# Altium project ThermoGo.PrjPcb
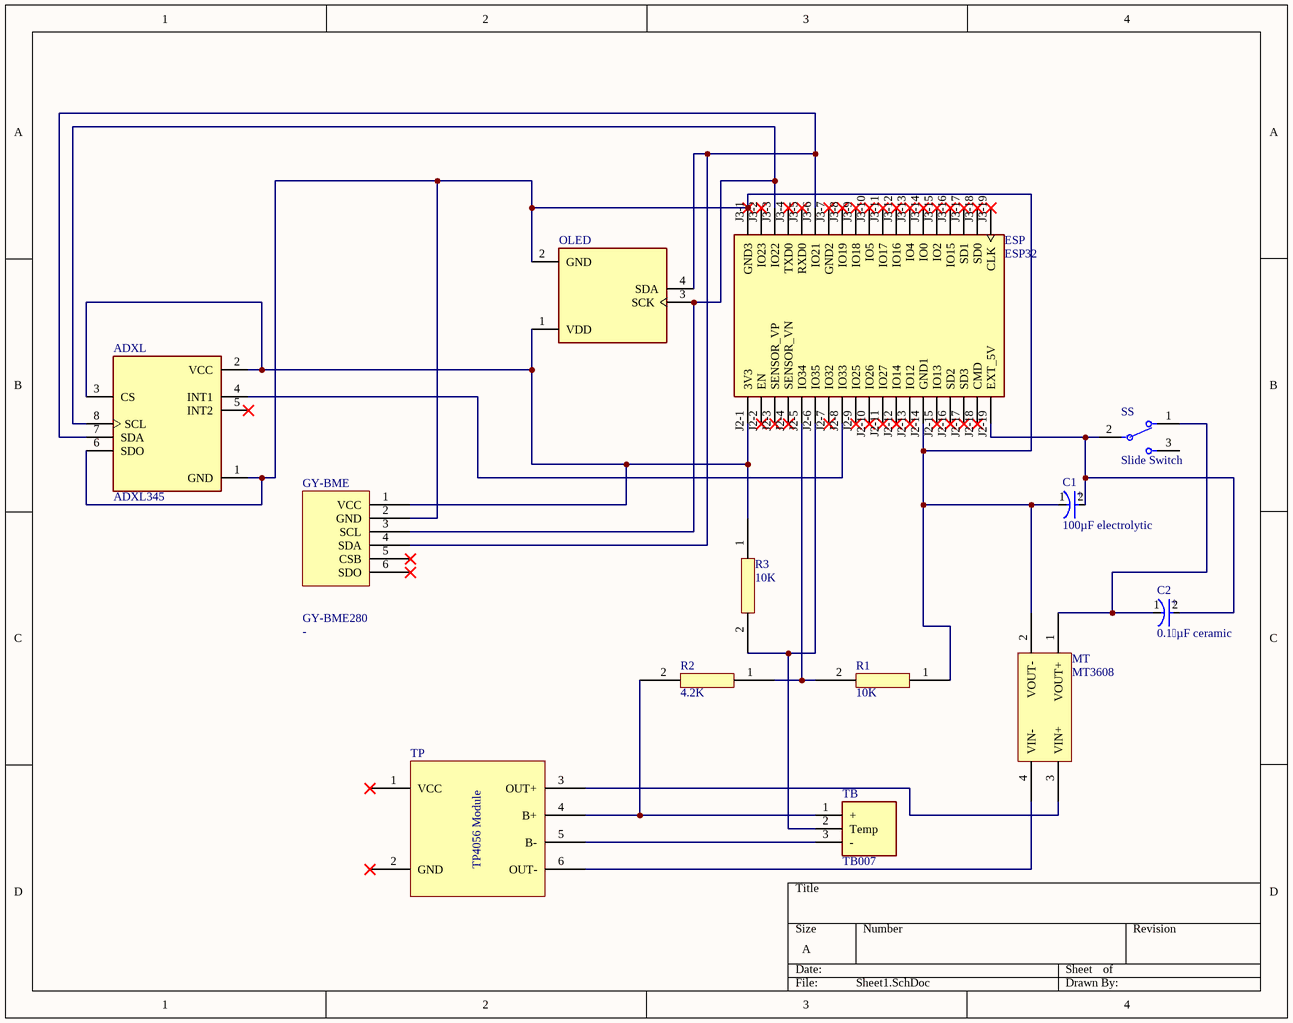
[diagram p0: Sheet1.SchDoc]
1 sheet, 13 parts. Net scope: global (net labels, ports and power ports of the same name join across sheets).
Board file: PCB1.PcbDoc

## Sheet Sheet1.SchDoc
size A; SheetNumber: 1; SheetTotal: 1

### Parts
ADXL  ADXL345  [ADXL345]
C1  100µF electrolytic  [FP-RAD-TH-D_6_3_0_5-L_11-MFG]
C2  0.1 µF ceramic  [FP-RAD-TH-D_6_3_0_5-L_11-MFG]
ESP  ESP32  [MODULE_ESP32-DEVKITC-32D]
GY-BME  -  [GY-BME280]
MT  MT3608  [MT3608]
OLED  (no value)  [LCD_OLED_128X64_1.3_I2C]
R1  10K  [resistor]
R2  4.2K  [resistor]
R3  10K  [resistor]
SS  Slide Switch  [FP-25436NAH6-MFG]
TB  TB007  [TB007]
TP  (no value)  [TP4056Module]

### Nets
NetADXL_1: ADXL.1(GND) ADXL.6(SDO) C1.1(C) ESP.J2-14(GND1) ESP.J3-1(GND3) GY-BME.2(GND) MT.2(VOUT-) OLED.2(GND) R1.1
NetADXL_2: ADXL.2(VCC) ADXL.3(CS) ESP.J2-1(3V3) GY-BME.1(VCC) OLED.1(VDD) R3.1
NetADXL_4: ADXL.4(INT1) ESP.J2-8(IO33)
NetADXL_7: ADXL.7(SDA) ESP.J3-6(IO21) GY-BME.4(SDA) OLED.4(SDA)
NetADXL_8: ADXL.8(SCL) ESP.J3-3(IO22) GY-BME.3(SCL) OLED.3(SCK)
NetC1_2: C1.2(A) C2.2(A) ESP.J2-19(EXT_5V) SS.2
NetC2_1: C2.1(C) MT.1(VOUT+) SS.1
NetESP_J2-5: ESP.J2-5(IO34) R1.2 R2.1
NetESP_J2-6: ESP.J2-6(IO35) R3.2 TB.2(Temp)
NetMT_3: MT.3(VIN+) TP.3(OUT+)
NetMT_4: MT.4(VIN-) TP.6(OUT-)
NetR2_2: R2.2 TB.1(+) TP.4(B+)
NetTB_3: TB.3(-) TP.5(B-)

Not connected (* = marked no-connect by the designer): ADXL 5(INT2)*; ESP J2-2(EN)* J2-3(SENSOR_VP)* J2-4(SENSOR_VN)* J2-7(IO32)* J2-9(IO25)* J2-10(IO26)* J2-11(IO27)* J2-12(IO14)* J2-13(IO12)* J2-15(IO13)* J2-16(SD2)* J2-17(SD3)* J2-18(CMD)* J3-2(IO23)* J3-4(TXD0)* J3-5(RXD0)* J3-7(GND2)* J3-8(IO19)* J3-9(IO18)* J3-10(IO5)* J3-11(IO17)* J3-12(IO16)* J3-13(IO4)* J3-14(IO0)* J3-15(IO2)* J3-16(IO15)* J3-17(SD1)* J3-18(SD0)* J3-19(CLK)*; GY-BME 5(CSB)* 6(SDO)*; SS 3; TP 1(VCC)* 2(GND)*

### Notes on the sheet
- (in symbol CMP-05427-000856-1) +
- (in symbol TP4056) TP4056 Module

### Library data of the parts
C1 C2 = CMP-05427-000856-1: Aluminum Electrolytic Capacitors (Radial Lead Type) 100uF ±20% 25V; Lead Diameter: 0.5mm; Polarity: Polar; Ripple Current: 455mA; Impedance: 130mR; Life (Hours): 2000Hour; Length: 11mm; Min Operating Temperature: -40°C; Termination: Radial; Diameter: 6mm; Lead Pitch: 5mm; Tolerance: 20%; Capacitance: 100uF; Case/Package: Radial; Voltage Rating (DC): 25V; Height - Seated (Max): 0.5inch; RoHS Compliant: Yes; Series: FM; Package Quantity: 2000; Voltage Rating: 25V; Max Operating Temperature: 105°C; Mount: Through Hole; ESR (Equivalent Series Resistance): 130mR; Packaging: Tape and Reel
GY-BME = GY-BME280
OLED = OLED_128X64_1.3_I2C: Non-Touch Graphic LCD Display Module Transmissive White OLED, Monochrome I2C 1.3 (33.02mm) 128 x 64; MF: UNIVERSAL-SOLDER Electronics Ltd; MP: OLED 128x64 1.3&quot; I2C; SnapEDA_Link: https://www.snapeda.com/parts/OLED%20128x64%201.3%22%20I2C/UNIVERSAL-SOLDER+Electronics+Ltd/view-part/?ref=snap; Package: None; Value: *; Check_prices: https://www.snapeda.com/parts/OLED%20128x64%201.3%22%20I2C/UNIVERSAL-SOLDER+Electronics+Ltd/view-part/?ref=eda
R1-R3 = resistor
SS = CMP-47022-000005-1: SWITCH SLIDE SPDT 4A 125V; Electrical Life: 10000Cycles; Switch Travel: 4mm; Actuator Type: Standard; Current Rating: 1A; Voltage Rating (DC): 30V; Actuator Material: Nylon; Mechanical Life: 20000Cycles; Actuator Length: 6mm; Contact Resistance: 10mR; Max Voltage Rating (AC): 250V; Switch Function: On-On; Packaging: Bulk; Package Quantity: 100; Contact Material: Silver; Orientation: Straight; Max Operating Temperature: 85°C; Min Operating Temperature: -40°C; Mount: Through Hole; Voltage Rating (AC): 125V; Max Voltage Rating (DC): 30V; Throw Configuration: SPDT; Series: 25000N; Termination: PC Pin
TP = TP4056